# Altium schematic sheet Sheet1.SchDoc
size A4
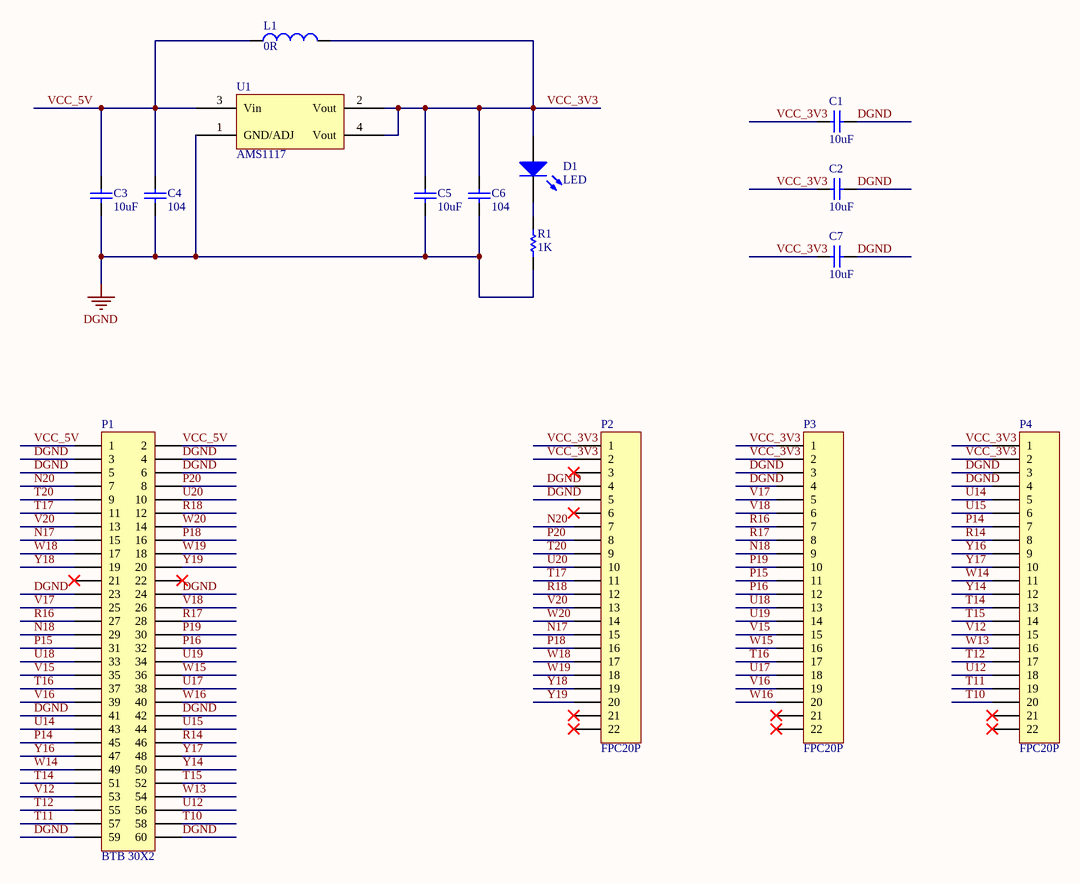
[diagram p0: Sheet1.SchDoc]

## Parts
C1  value 10uF  [R0805]  (hidden comment: Cap)
C2  value 10uF  [R0805]  (hidden comment: Cap)
C3  value 10uF  [R0805]  (hidden comment: Cap)
C4  value 104  [R0805]  (hidden comment: Cap)
C5  value 10uF  [R0805]  (hidden comment: Cap)
C6  value 104  [R0805]  (hidden comment: Cap)
C7  value 10uF  [R0805]  (hidden comment: Cap)
D1  LED  [LED0805红]
L1  value 0R  [R0805]  (hidden comment: Inductor)
P1  BTB 30X2  [BTBCON_0.8mm_60P]
P2  FPC20P  [FPC20Pin]
P3  FPC20P  [FPC20Pin]
P4  FPC20P  [FPC20Pin]
R1  value 1K  [R0805]  (hidden comment: Res1)
U1  AMS1117  [SOT-223   AMS1117]

## Nets
DGND: C1.1 C2.1 C3.1 C4.1 C5.1 C6.1 C7.1 P1.3 P1.4 P1.5 P1.6 P1.23 P1.24 P1.41 P1.42 P1.59 P1.60 P2.4 P2.5 P3.3 P3.4 P4.3 P4.4 R1.1 U1.1(GND/ADJ)
N17: P1.15 P2.15
N18: P1.29 P3.9
N20: P1.7 P2.7
P14: P1.45 P4.7
P15: P1.31 P3.11
P16: P1.32 P3.12
P18: P1.16 P2.16
P19: P1.30 P3.10
P20: P1.8 P2.8
R14: P1.46 P4.8
R16: P1.27 P3.7
R17: P1.28 P3.8
R18: P1.12 P2.12
T10: P1.58 P4.20
T11: P1.57 P4.19
T12: P1.55 P4.17
T14: P1.51 P4.13
T15: P1.52 P4.14
T16: P1.37 P3.17
T17: P1.11 P2.11
T20: P1.9 P2.9
U12: P1.56 P4.18
U14: P1.43 P4.5
U15: P1.44 P4.6
U17: P1.38 P3.18
U18: P1.33 P3.13
U19: P1.34 P3.14
U20: P1.10 P2.10
V12: P1.53 P4.15
V15: P1.35 P3.15
V16: P1.39 P3.19
V17: P1.25 P3.5
V18: P1.26 P3.6
V20: P1.13 P2.13
VCC_3V3: C1.2 C2.2 C5.2 C6.2 C7.2 D1.1(A) L1.2 P2.1 P2.2 P3.1 P3.2 P4.1 P4.2 U1.2(Vout) U1.4(Vout)
VCC_5V: C3.2 C4.2 L1.1 P1.1 P1.2 U1.3(Vin)
W13: P1.54 P4.16
W14: P1.49 P4.11
W15: P1.36 P3.16
W16: P1.40 P3.20
W18: P1.17 P2.17
W19: P1.18 P2.18
W20: P1.14 P2.14
Y14: P1.50 P4.12
Y16: P1.47 P4.9
Y17: P1.48 P4.10
Y18: P1.19 P2.19
Y19: P1.20 P2.20
NetD1_2: D1.2(K) R1.2

Not connected (* = marked no-connect by the designer): P1 21* 22*; P2 3* 6* 21* 22*; P3 21* 22*; P4 21* 22*

## Library data of the parts
C1-C7 = Cap: Capacitor; Published: 8-Jun-2000; LatestRevisionDate: 17-Jul-2002; LatestRevisionNote: Re-released for DXP Platform.; PackageReference: RAD-0.3; Publisher: Altium Limited; PackageDescription: Radial Cap, Thru-Hole; 2 Leads; 0.3 in Pin Spacing
D1 = LED0: Typical INFRARED GaAs LED; Published: 8-Jun-2000; LatestRevisionDate: 08-Jul-2005; LatestRevisionNote: Mech Layer 1 removed.; PackageReference: LED-0; Publisher: Altium Limited; PackageDescription: LED; 2 Leads
L1 = Inductor: Code_IEC: 1005; Published: 8-Jun-2000; LatestRevisionDate: 29-May-2009; LatestRevisionNote: IPC-7351 Footprint Added.; PackageReference: 0402-A; Publisher: Altium Limited; PackageDescription: Chip Inductor; Code_JEITA: 0402
P1 = Header 30X2: Header, 30-Pin, Dual row; LatestRevisionDate: 17-Jul-2002; LatestRevisionNote: Re-released for DXP Platform.; Publisher: Altium Limited
P2-P4 = Header 22: Header, 22-Pin; LatestRevisionDate: 17-Jul-2002; LatestRevisionNote: Re-released for DXP Platform.; Publisher: Altium Limited
R1 = Res1: Resistor; Published: 8-Jun-2000; LatestRevisionDate: 17-Jul-2002; LatestRevisionNote: Re-released for DXP Platform.; PackageReference: AXIAL-0.3; Publisher: Altium Limited; PackageDescription: Axial Device, Thru-Hole; 2 Leads; 0.3 in Pin Spacing